# EAGLE design Pico Audio v0.10 (EAGLE 9.4.2)
COMPANY: AKSevenFour; CREVISION: v0.10; DATE: 30-10-2018; DRAWN: Adam Keher; TITLE: TinyPICO Audio Board
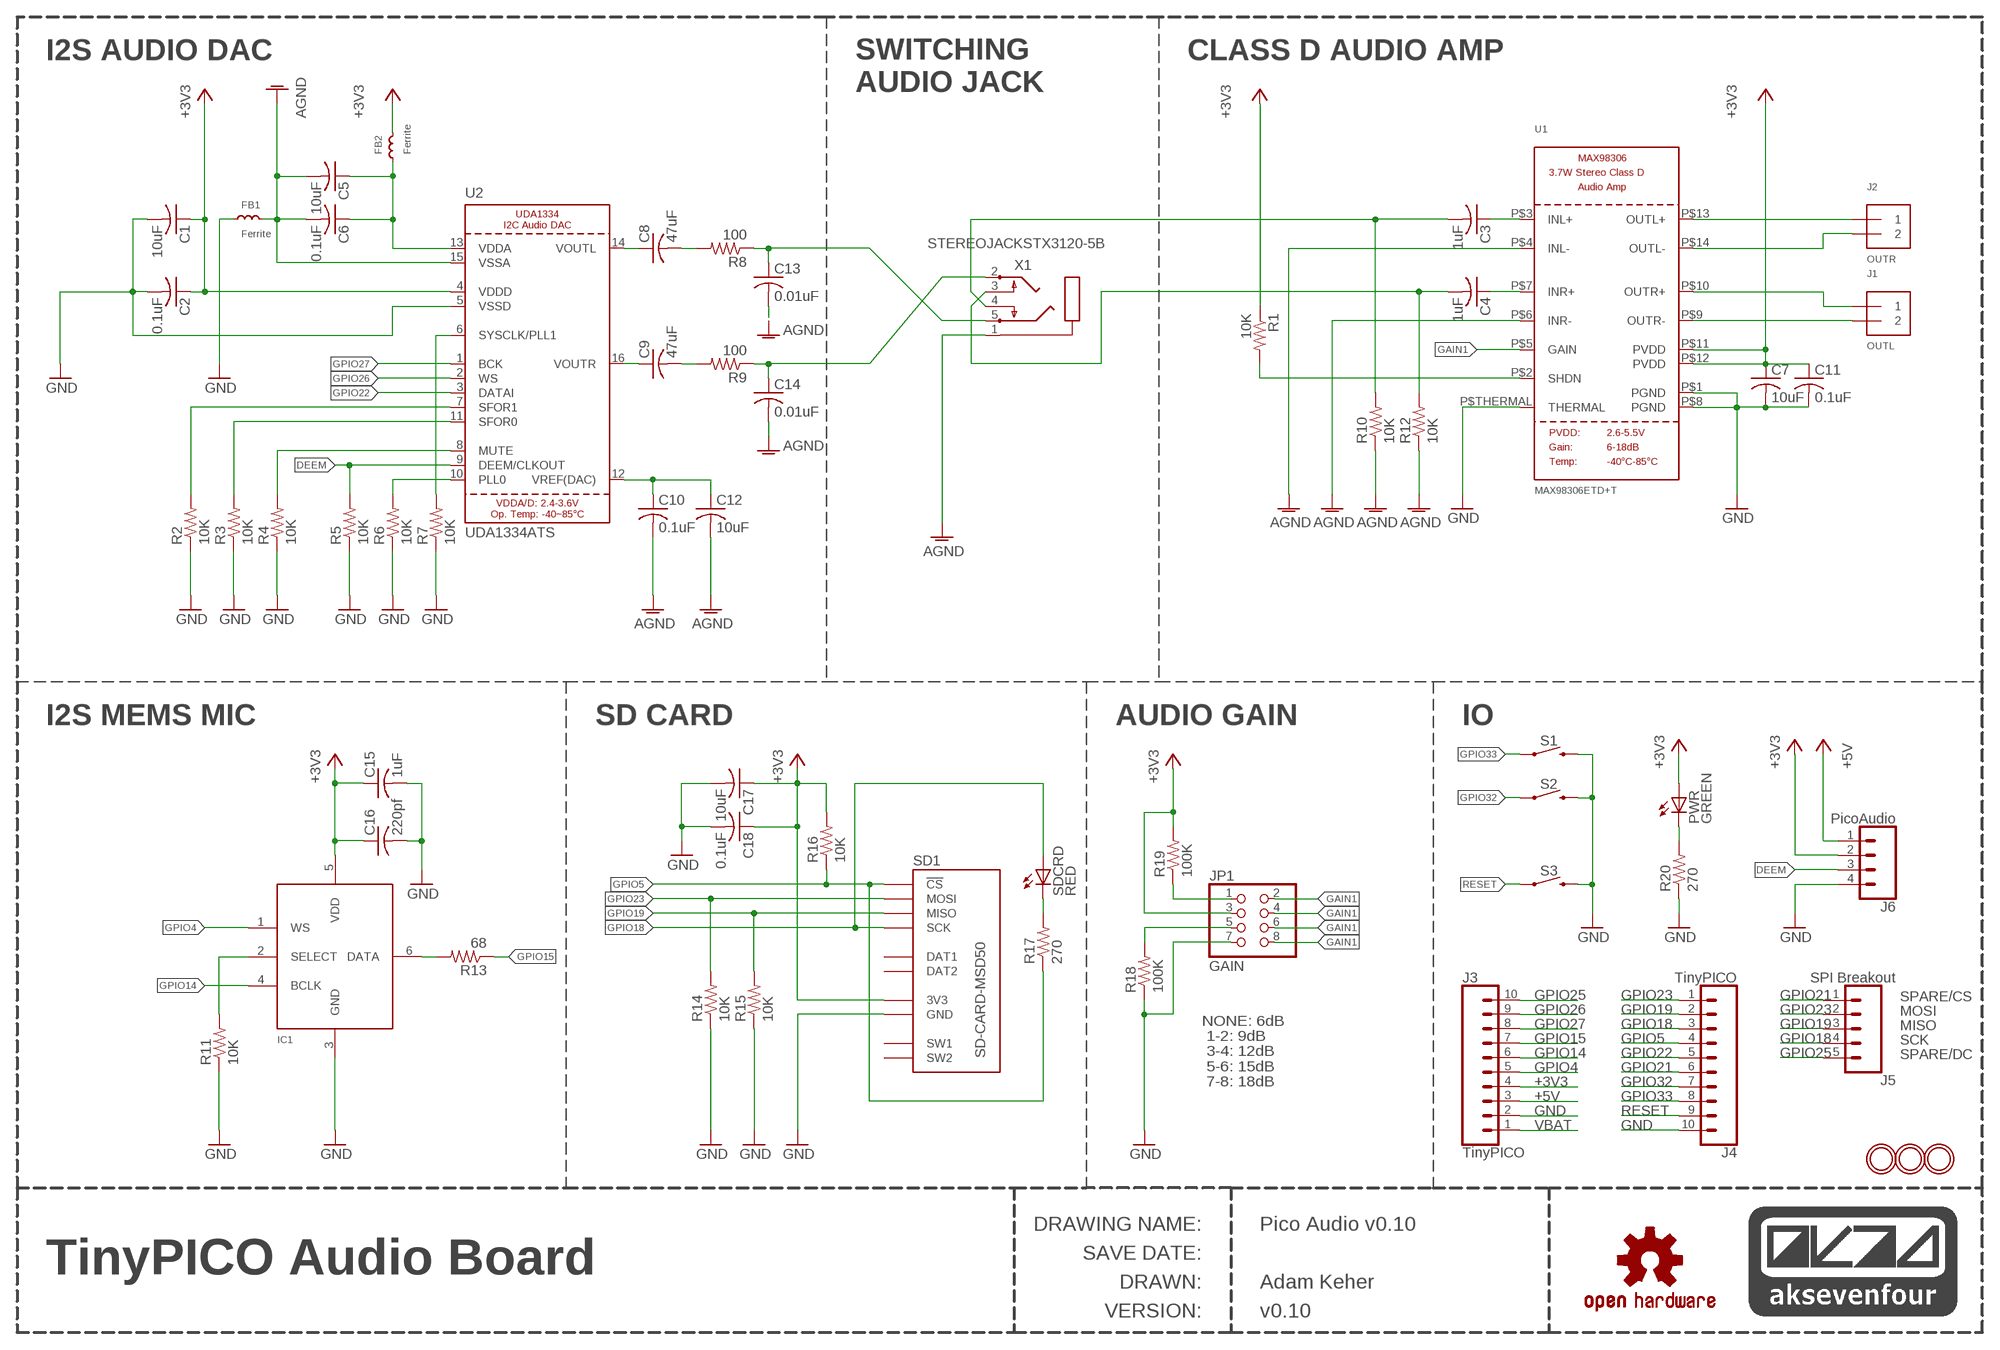
[diagram p0: schematic, sheet 1]

## Parts
AK74LOGO2  AK74_LOGO  [AK74_LOGO_MEDIUM_TEXTONLY]
C1  10uF  C-USC0603K  [C0603K]
C2  0.1uF  C-USC0402K  [C0402K]
C3  1uF  C-USC0402K  [C0402K]
C4  1uF  C-USC0402K  [C0402K]
C5  10uF  C-USC0603K  [C0603K]
C6  0.1uF  C-USC0402K  [C0402K]
C7  10uF  C-USC0603K  [C0603K]
C8  47uF  C-USC1210K  [C1210K]
C9  47uF  C-USC1210K  [C1210K]
C10  0.1uF  C-USC0402K  [C0402K]
C11  0.1uF  C-USC0402K  [C0402K]
C12  10uF  C-USC0603K  [C0603K]
C13  0.01uF  C-USC0402K  [C0402K]
C14  0.01uF  C-USC0402K  [C0402K]
C15  1uF  C-USC0402K  [C0402K]
C16  220pf  C-USC0402K  [C0402K]
C17  10uF  C-USC0603K  [C0603K]
C18  0.1uF  C-USC0402K  [C0402K]
FB1  Ferrite  FERRITEL0805  [R0805]
FB2  Ferrite  FERRITEL0805  [R0805]
IC1  MIC_I2S_SPH0645  [SPH0645LM4H]
J1  OUTL  TERMBLOCK_1X2  [TERMBLOCK_1X2-3.5MM]
J2  OUTR  TERMBLOCK_1X2  [TERMBLOCK_1X2-3.5MM]
J3  TinyPICO  TINYPICO_HEADER_10NO_SILK_PTH_FEMALE  [1X10_NO_SILK]
J4  TinyPICO  TINYPICO_HEADER_10NO_SILK_PTH_FEMALE  [1X10_NO_SILK]
J5  SPI Breakout  CONN_05NO_SILK  [1X05_NO_SILK]
J6  PicoAudio  CONN_041X04_NO_SILK  [1X04_NO_SILK]
JP1  GAIN  PINHD-2X4  [2X04]
LOGO2  OSHW-LOGOM  [OSHW-LOGO-M]
PWR  GREEN  LEDCHIP-LED0805  [CHIP-LED0805]
R1  10K  R-US_R0402  [R0402]
R2  10K  R-US_R0402  [R0402]
R3  10K  R-US_R0402  [R0402]
R4  10K  R-US_R0402  [R0402]
R5  10K  R-US_R0402  [R0402]
R6  10K  R-US_R0402  [R0402]
R7  10K  R-US_R0402  [R0402]
R8  100  R-US_R0402  [R0402]
R9  100  R-US_R0402  [R0402]
R10  10K  R-US_R0402  [R0402]
R11  10K  R-US_R0402  [R0402]
R12  10K  R-US_R0402  [R0402]
R13  68  R-US_R0402  [R0402]
R14  10K  R-US_R0402  [R0402]
R15  10K  R-US_R0402  [R0402]
R16  10K  R-US_R0402  [R0402]
R17  270  R-US_R0402  [R0402]
R18  100K  R-US_R0402  [R0402]
R19  100K  R-US_R0402  [R0402]
R20  270  R-US_R0402  [R0402]
S1  MOMENTARY-SWITCH-SPST-SMD-4.6X2.8MM  [TACTILE_SWITCH_SMD_4.6X2.8MM]
S2  MOMENTARY-SWITCH-SPST-SMD-4.6X2.8MM  [TACTILE_SWITCH_SMD_4.6X2.8MM]
S3  MOMENTARY-SWITCH-SPST-SMD-4.6X2.8MM  [TACTILE_SWITCH_SMD_4.6X2.8MM]
SD1  SD-CARD-MSD50  [SD_5031821853]
SDCRD  RED  LEDCHIP-LED0805  [CHIP-LED0805]
U1  MAX98306ETD+T  AUDIOAMP_MAX98306  [TDFN14_3X3MM]
U2  UDA1334ATS  AUDIO_I2S_UDA1334""  [SSOP16_4.4MM]
U$12  MOUNTINGHOLE2.5  [MOUNTINGHOLE_2.5_PLATED]
U$13  MOUNTINGHOLE2.5  [MOUNTINGHOLE_2.5_PLATED]
U$14  MOUNTINGHOLE2.5  [MOUNTINGHOLE_2.5_PLATED]
X1  STEREOJACKSTX3120-5B  [STX3100]

## Nets
+3V3 [power1]: C1.1 C2.1 C7.1 C11.1 C15.1 C16.1 C17.1 C18.1 FB2.2 IC1.5(VDD) J3.4 J6.2 JP1.3 PWR.A R1.1 R16.2 R19.2 SD1.VCC(3V3) U1.P$11(PVDD) U1.P$12(PVDD) U2.4(VDDD)
+5V [power1]: J3.3 J6.1
AGND [power1]: C5.2 C6.2 C10.2 C12.2 C13.2 C14.2 FB1.2 R10.1 R12.1 U1.P$4(INL-) U1.P$6(INR-) U2.15(VSSA) X1.1
DEEM: J6.3 R5.2 U2.9(DEEM/CLKOUT)
GAIN1: JP1.2 JP1.4 JP1.6 JP1.8 U1.P$5(GAIN)
GND [power1]: C1.2 C2.2 C7.2 C11.2 C15.2 C16.2 C17.2 C18.2 FB1.1 IC1.3(GND) J3.2 J4.10 J6.4 JP1.7 R2.1 R3.1 R4.1 R5.1 R6.1 R7.1 R11.1 R14.1 R15.1 R18.1 R20.1 S1.3 S1.4 S2.3 S2.4 S3.3 S3.4 SD1.GND U1.P$1(PGND) U1.P$8(PGND) U1.P$THERMAL(THERMAL) U2.5(VSSD)
GPIO4: IC1.1(WS) J3.5
GPIO5: J4.4 R16.1 R17.1 SD1.CS(!CS)
GPIO14: IC1.4(BCLK) J3.6
GPIO15: J3.7 R13.1
GPIO18: J4.3 J5.4 SD1.SCK SDCRD.A
GPIO19: J4.2 J5.3 R15.2 SD1.MISO
GPIO21: J4.6 J5.1
GPIO22: J4.5 U2.3(DATAI)
GPIO23: J4.1 J5.2 R14.2 SD1.MOSI
GPIO25: J3.10 J5.5
GPIO26: J3.9 U2.2(WS)
GPIO27: J3.8 U2.1(BCK)
GPIO32: J4.7 S2.1 S2.2
GPIO33: J4.8 S1.1 S1.2
N$1: C5.1 C6.1 FB2.1 U2.13(VDDA)
N$2: C3.1 U1.P$3(INL+)
N$3: R2.2 U2.7(SFOR1)
N$4: C4.1 U1.P$7(INR+)
N$5: R3.2 U2.11(SFOR0)
N$6: R4.2 U2.8(MUTE)
N$8: PWR.C R20.2
N$10: R6.2 U2.10(PLL0)
N$11: R7.2 U2.6(SYSCLK/PLL1)
N$14: C10.1 C12.1 U2.12(VREF(DAC))
N$15: C8.1 U2.14(VOUTL)
N$16: C9.2 R9.2
N$17 [power1]: J1.2 U1.P$9(OUTR-)
N$18 [power1]: J2.2 U1.P$14(OUTL-)
N$19: C8.2 R8.2
N$20: IC1.2(SELECT) R11.2
N$21: C9.1 U2.16(VOUTR)
N$22: IC1.6(DATA) R13.2
N$24: JP1.1 R19.1
N$25: JP1.5 R18.2
N$26 [power1]: J2.1 U1.P$13(OUTL+)
N$27: R17.2 SDCRD.C
N$28 [power1]: J1.1 U1.P$10(OUTR+)
RESET: J4.9 S3.1 S3.2
SHUTDOWN: R1.2 U1.P$2(SHDN)
VBAT [power1]: J3.1
VINL [power1]: C3.2 R10.2 X1.4
VINR [power1]: C4.2 R12.2 X1.3
VOUTL [power1]: C13.1 R8.1 X1.5
VOUTR [power1]: C14.1 R9.1 X1.2
Unconnected: SD1.DAT1 SD1.DAT2 SD1.SW1 SD1.SW2

## Notes on the sheet
- I2S AUDIO DAC | CLASS D AUDIO AMP
- SWITCHING
  AUDIO JACK
- I2S MEMS MIC | SD CARD | AUDIO GAIN | IO
- SPARE/CS
- MOSI
- MISO
- SCK
- SPARE/DC
- NONE: 6dB
   1-2: 9dB
   3-4: 12dB
   5-6: 15dB
   7-8: 18dB
- DRAWING NAME:
- SAVE DATE:
- DRAWN:
- VERSION:

## Library data of the parts
AK74LOGO2 = AK74:AK74_LOGO
C1-C18 = rcl:C-US: CAPACITOR, American symbol; SPICEPREFIX: C
FB1 FB2 = AK74:FERRITE
IC1 = microbuilder:MIC_I2S
J1 J2 = microbuilder:TERMBLOCK_1X2: 3.5mm Terminal block http://www.ladyada.net/library/pcb/eaglelibrary.html
J3 J4 = UnexpectedMaker:TINYPICO_HEADER_10: Multi connection point. Often used as Generic Header-pin footprint for 0.1 inch spaced/style header connections On any of the 0.1 inch spaced packages, you can populate with these: Break Away Headers - Straight <https://www.sparkfun.com/products/116> (PRT-00116) Break Away Male Headers - Right Angle <https://www.sparkfun.com/products/553> (PRT-00553) Female Headers <https://www.sparkfun.com/products/115> (PRT-00115) Break Away Headers - Machine Pin <https://www.sparkfun.com/products/117> (PRT-00117) Break Away Female Headers - Swiss Machine Pin <https://www.sparkfun.com/products/743> (PRT-00743) Arduino Stackable Header - 10 Pin <https://www.sparkfun.com/products/11376> (PRT-11376) For SCREWTERMINALS and SPRING TERMINALS visit here: Screw Terimnals on SparkFun.com <https://www.sparkfun.com/search/results?term=Screw+Terminals> (5mm/3.5mm/2.54mm spacing) This device is also useful as a general connection point to wire up your design to another part of your project. Our various solder wires solder well into these plated through hole pads. Hook-Up Wire - Assortment (Stranded, 22 AWG) <https://www.sparkfun.com/products/11375> (PRT-11375) Hook-Up Wire - Assortment (Solid Core, 22 AWG) <https://www.sparkfun.com/products/11367> (PRT-11367) View the entire wire category on our website here <https://www.sparkfun.com/categories/141> Special notes: Molex polarized connector foot print use with SKU : PRT-08231 with associated crimp pins and housings. 1MM SMD Version SKU: PRT-10208 NOTES ON THE VARIANTS LOCK and LOCK_LONGPADS... This footprint was designed to help hold the alignment of a through-hole component (i.e. 6-pin header) while soldering it into place. You may notice that each hole has been shifted either up or down by 0.005 of an inch from it's more standard position (which is a perfectly straight line). This slight alteration caused the pins (the squares in the middle) to touch the edges of the holes. Because they are alternating, it causes a "brace" to hold the component in place. 0.005 has proven to be the perfect amount of "off-center" position when using our standard breakaway headers. Although looks a little odd when you look at the bare footprint, once you have a header in there, the alteration is very hard to notice. Also,if you push a header all the way into place, it is covered up entirely on the bottom side.; PROD_ID: CONN-11563
J5 = SparkFun-Connectors:CONN_05: Multi connection point. Often used as Generic Header-pin footprint for 0.1 inch spaced/style header connections On any of the 0.1 inch spaced packages, you can populate with these: Break Away Headers - Straight <https://www.sparkfun.com/products/116> (PRT-00116) Break Away Male Headers - Right Angle <https://www.sparkfun.com/products/553> (PRT-00553) Female Headers <https://www.sparkfun.com/products/115> (PRT-00115) Break Away Headers - Machine Pin <https://www.sparkfun.com/products/117> (PRT-00117) Break Away Female Headers - Swiss Machine Pin <https://www.sparkfun.com/products/743> (PRT-00743) For SCREWTERMINALS and SPRING TERMINALS visit here: Screw Terimnals on SparkFun.com <https://www.sparkfun.com/search/results?term=Screw+Terminals> (5mm/3.5mm/2.54mm spacing) This device is also useful as a general connection point to wire up your design to another part of your project. Our various solder wires solder well into these plated through hole pads. Hook-Up Wire - Assortment (Stranded, 22 AWG) <https://www.sparkfun.com/products/11375> (PRT-11375) Hook-Up Wire - Assortment (Solid Core, 22 AWG) <https://www.sparkfun.com/products/11367> (PRT-11367) View the entire wire category on our website here <https://www.sparkfun.com/categories/141> Special notes: Molex polarized connector foot print use with SKU : PRT-08231 with associated crimp pins and housings. 1MM SMD Version SKU: PRT-10208
J6 = SparkFun-Connectors:CONN_04: Multi connection point. Often used as Generic Header-pin footprint for 0.1 inch spaced/style header connections On any of the 0.1 inch spaced packages, you can populate with these: Break Away Headers - Straight <https://www.sparkfun.com/products/116> (PRT-00116) Break Away Male Headers - Right Angle <https://www.sparkfun.com/products/553> (PRT-00553) Female Headers <https://www.sparkfun.com/products/115> (PRT-00115) Break Away Headers - Machine Pin <https://www.sparkfun.com/products/117> (PRT-00117) Break Away Female Headers - Swiss Machine Pin <https://www.sparkfun.com/products/743> (PRT-00743) For SCREWTERMINALS and SPRING TERMINALS visit here: Screw Terimnals on SparkFun.com <https://www.sparkfun.com/search/results?term=Screw+Terminals> (5mm/3.5mm/2.54mm spacing) This device is also useful as a general connection point to wire up your design to another part of your project. Our various solder wires solder well into these plated through hole pads. Hook-Up Wire - Assortment (Stranded, 22 AWG) <https://www.sparkfun.com/products/11375> (PRT-11375) Hook-Up Wire - Assortment (Solid Core, 22 AWG) <https://www.sparkfun.com/products/11367> (PRT-11367) View the entire wire category on our website here <https://www.sparkfun.com/categories/141> Special notes: Molex polarized connector foot print use with SKU : PRT-08231 with associated crimp pins and housings. 1MM SMD Version SKU: PRT-10208; PROD_ID: CONN-09696
JP1 = pinhead:PINHD-2X4: PIN HEADER
LOGO2 = SparkFun-Aesthetics:OSHW-LOGO: Open Source Hardware Logo This logo indicates the piece of hardware it is found on incorporates a OSHW license and/or adheres to the definition of open source hardware found here: http://freedomdefined.org/OSHW
PWR SDCRD = led:LED: LED OSRAM: - CHIPLED LG R971, LG N971, LY N971, LG Q971, LY Q971, LO R971, LY R971 LH N974, LH R974 LS Q976, LO Q976, LY Q976 LO Q996 - Hyper CHIPLED LW Q18S LB Q993, LB Q99A, LB R99A - SideLED LS A670, LO A670, LY A670, LG A670, LP A670 LB A673, LV A673, LT A673, LW A673 LH A674 LY A675 LS A676, LA A676, LO A676, LY A676, LW A676 LS A679, LY A679, LG A679 - Hyper Micro SIDELED® LS Y876, LA Y876, LO Y876, LY Y876 LT Y87S - SmartLED LW L88C, LW L88S LB L89C, LB L89S, LG L890 LS L89K, LO L89K, LY L89K LS L896, LA L896, LO L896, LY L896 - TOPLED LS T670, LO T670, LY T670, LG T670, LP T670 LSG T670, LSP T670, LSY T670, LOP T670, LYG T670 LG T671, LOG T671, LSG T671 LB T673, LV T673, LT T673, LW T673 LH T674 LS T676, LA T676, LO T676, LY T676, LB T676, LH T676, LSB T676, LW T676 LB T67C, LV T67C, LT T67C, LS T67K, LO T67K, LY T67K, LW E67C LS E67B, LA E67B, LO E67B, LY E67B, LB E67C, LV E67C, LT E67C LW T67C LS T679, LY T679, LG T679 LS T770, LO T770, LY T770, LG T770, LP T770 LB T773, LV T773, LT T773, LW T773 LH T774 LS E675, LA E675, LY E675, LS T675 LS T776, LA T776, LO T776, LY T776, LB T776 LHGB T686 LT T68C, LB T68C - Hyper Mini TOPLED® LB M676 - Mini TOPLED Santana® LG M470 LS M47K, LO M47K, LY M47K Source: http://www.osram.convergy.de LUXEON: - LUMILED® LXK2-PW12-R00, LXK2-PW12-S00, LXK2-PW14-U00, LXK2-PW14-V00 LXK2-PM12-R00, LXK2-PM12-S00, LXK2-PM14-U00 LXK2-PE12-Q00, LXK2-PE12-R00, LXK2-PE12-S00, LXK2-PE14-T00, LXK2-PE14-U00 LXK2-PB12-K00, LXK2-PB12-L00, LXK2-PB12-M00, LXK2-PB14-N00, LXK2-PB14-P00, LXK2-PB14-Q00 LXK2-PR12-L00, LXK2-PR12-M00, LXK2-PR14-Q00, LXK2-PR14-R00 LXK2-PD12-Q00, LXK2-PD12-R00, LXK2-PD12-S00 LXK2-PH12-R00, LXK2-PH12-S00 LXK2-PL12-P00, LXK2-PL12-Q00, LXK2-PL12-R00 Source: www.luxeon.com KINGBRIGHT: KA-3528ASYC Source: www.kingbright.com
R1-R20 = rcl:R-US_: RESISTOR, American symbol; SPICEPREFIX: R
S1-S3 = SparkFun-Switches:MOMENTARY-SWITCH-SPST: Momentary Switch (Pushbutton) - SPST Normally-open (NO) SPST momentary switches (buttons, pushbuttons). Variants PTH-12MM - 12mm square, through-hole Momentary Pushbutton Switch - 12mm Square <https://www.sparkfun.com/products/9190> (COM-09190) PTH-6.0MM, PTH-6.0MM-KIT - 6.0mm square, through-hole Mini Pushbutton Switch <https://www.sparkfun.com/products/97> (COM-00097) KIT package intended for soldering kit's - only one side of pads' copper is exposed. PTH-RIGHT-ANGLE-KIT - Right-angle, through-hole Right Angle Tactile Button <https://www.sparkfun.com/products/10791> - Used on SparkFun BigTime Watch Kit <https://www.sparkfun.com/products/11734> SMD-12MM - 12mm square, surface-mount Tactile Button - SMD (12mm) <https://www.sparkfun.com/products/12993> (COM-12993) Used on SparkFun PicoBoard <https://www.sparkfun.com/products/11888> SMD-4.5MM - 4.5mm Square Trackball Switch Used on SparkFun Blackberry Trackballer Breakout <https://www.sparkfun.com/products/13169> SMD-4.6MMX2.8MM - 4.60mm x 2.80mm, surface mount Used on SparkFun SAMD21 Mini Breakout <https://www.sparkfun.com/products/13664> SMD-5.2MM, SMD-5.2-REDUNDANT - 5.2mm square, surface-mount Mini Pushbutton Switch - SMD <https://www.sparkfun.com/products/8720> (COM-08720) Used on Arduino Pro Mini <https://www.sparkfun.com/products/11114> REDUNDANT package connects both switch circuits together SMD-6.0X3.5MM - 6.0 x 3.5mm, surface mount Momentary Reset Switch SMD <https://www.sparkfun.com/products/8229> (COM-08229) SMD-6.2MM-TALL - 6.2mm square, surface mount Tactile Button - SMD (6mm) <https://www.sparkfun.com/products/12992> Used on SparkFun Digital Sandbox <https://www.sparkfun.com/products/12651> SMD-RIGHT-ANGLE - Right-angle, surface mount Used on SparkFun Block for Intel® Edison - Arduino <https://www.sparkfun.com/products/13036>; PROD_ID: SWCH-13065
SD1 = we-con:SD-CARD: SD-Card Sockets; DIGIKEY: WM9750TR-ND
U1 = microbuilder:AUDIOAMP_MAX98306: MAX98306 3.7W Stereo Audio Amp - TDFN14 3.7W @ 3 ohm, 2.6-5.5V supply, 6-18dB selectable gain
U2 = microbuilder:AUDIO_I2S_UDA1334: UDA1334 I2C Audio DAC Power Supply: 2.4-3.6V Sample frequencies from 16-100kHz
U$12-U$14 = microbuilder:MOUNTINGHOLE: Mounting Hole For #2 screws (0.086"/2.18mm width, 0.094"/2.4mm hole) use 2.5mm; BOM: EXCLUDE
X1 = AK74:STEREOJACK: MIC/HEADPHONE JACK Stereo jack with two switches. Kycon STX3100, CUI SJ1-3555NG and/or 4UCon 05544

## Net classes
0 default: width 0.152 mm
1 power1: width 0.254 mm

## Board
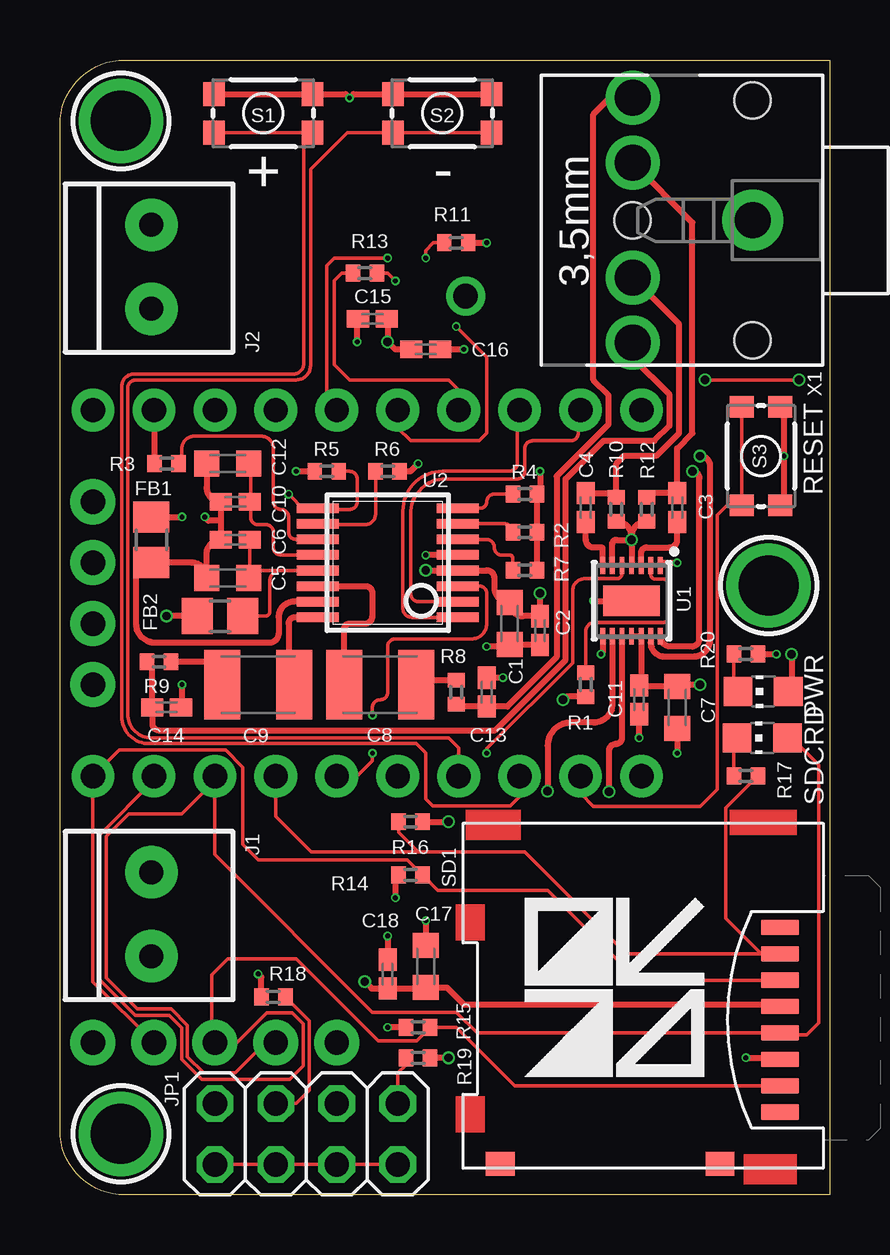
[diagram p1: board, top side]
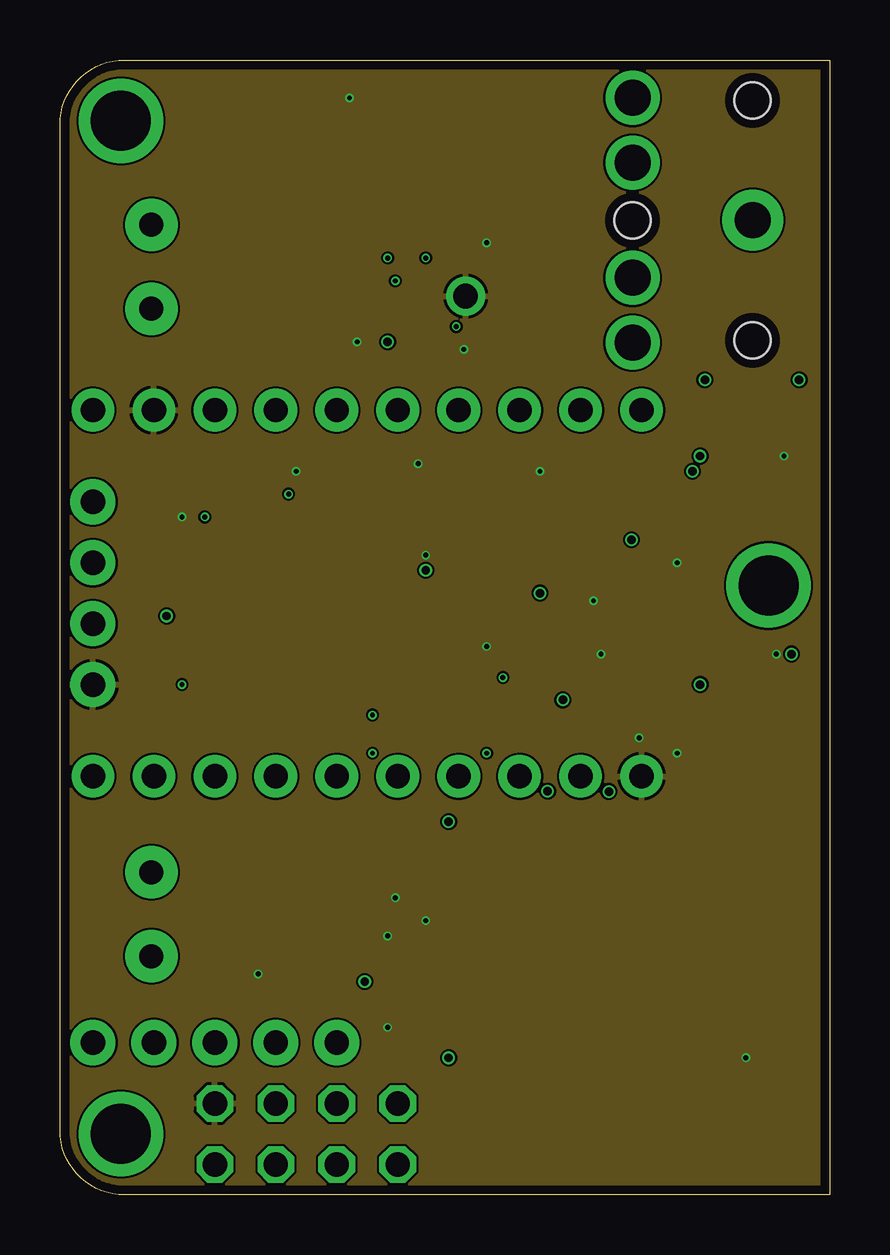
[diagram p2: board, inner layer GND]
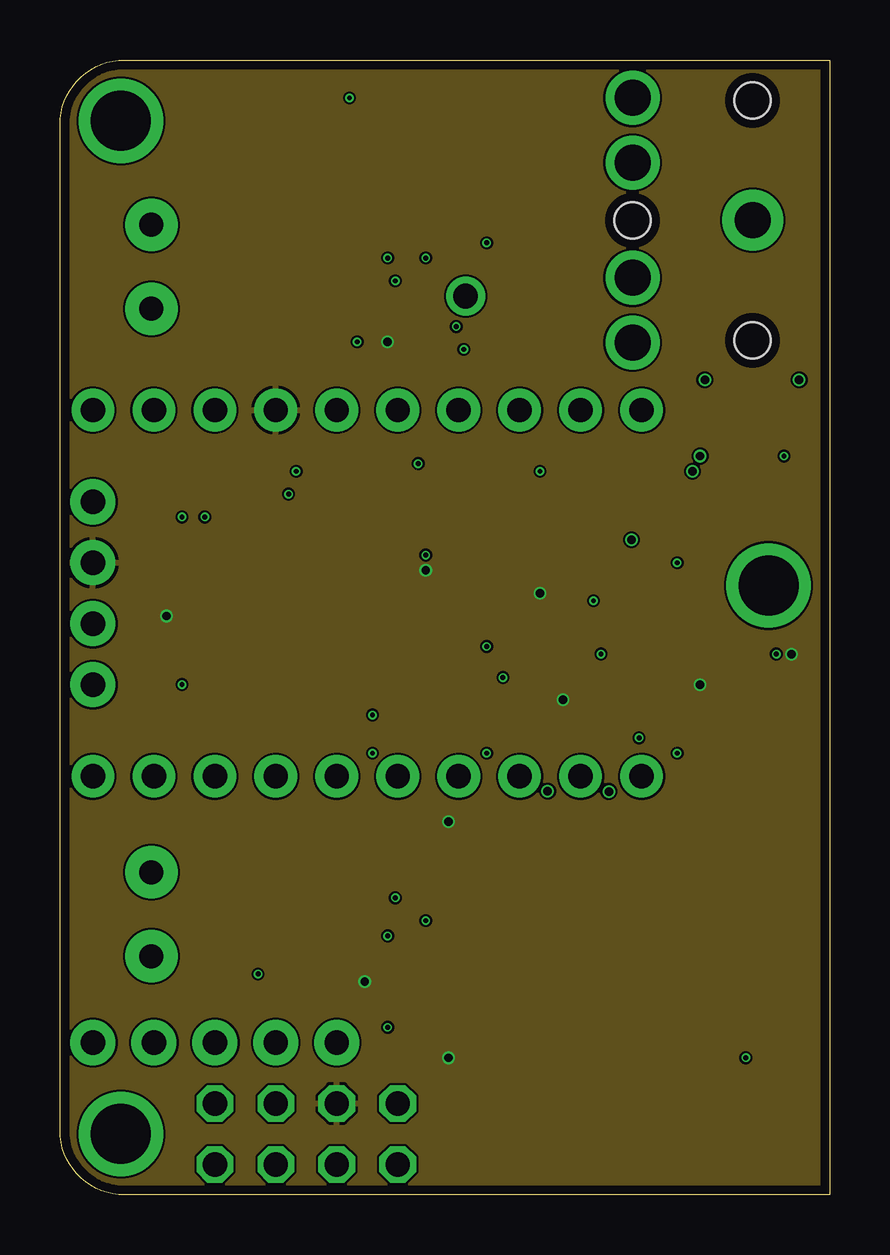
[diagram p3: board, inner layer PWR]
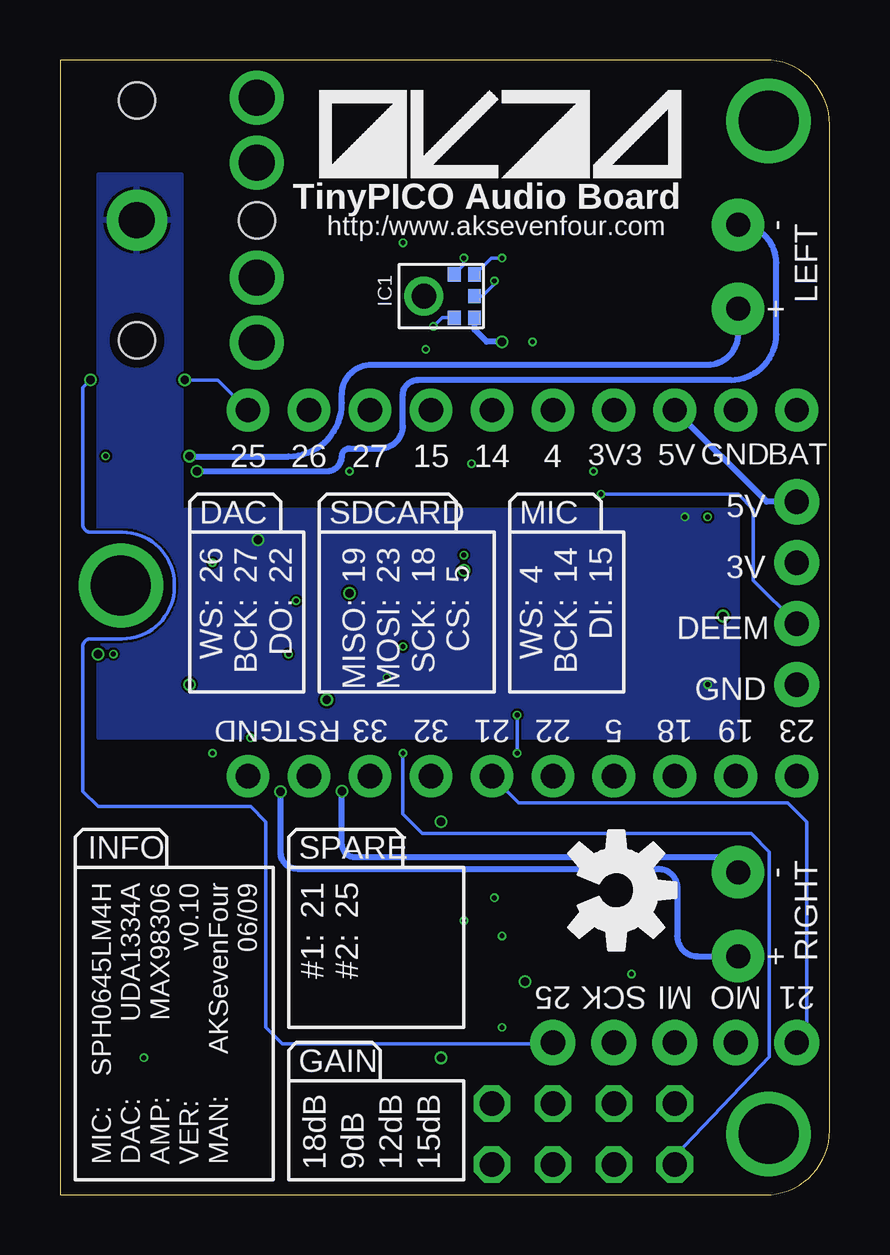
[diagram p4: board, bottom side, seen from below]

Size 32.07 x 47.31 mm. Coordinates in mm from the lower left corner, seen from the top.
Outline: 32.07,0 2.69,0 arc-90 0,2.69 0,44.62 arc-90 2.69,47.31 32.07,47.31 32.07,0
Copper layers (1+2*15+16): Top 0.07mm / dielectric 1.5mm / GND 0.035mm / dielectric 0.15mm / PWR 0.035mm / dielectric 0.2mm / Bottom 0.07mm
Design rules "jlcpcb-4layer-updated": minimum track width 3.5mil, minimum drill 0.2mm, track to track 3.5mil, track to pad 5mil, pad to pad 5mil, via to via 5mil, smd to smd 5mil, copper to edge 15mil, drill to drill 5mil, minimum pad ring 7mil, minimum via ring 3mil, stop-mask expansion 3mil, vias tented up to drill 20mil, thermal gap 5mil

### Footprints (pad centres in the part's own frame; a part is rotated, then mirrored left to right if it is on the bottom)
C0603K = smd 1.05 x 1.08: 1 -0.875,0; 2 0.875,0
C0402K = smd 0.925 x 0.74: 1 -0.6,0; 2 0.6,0
C1210K = smd 1.5 x 2.9: 1 -1.5,0; 2 1.5,0
R0805 = smd 1.3 x 1.5: 1 -0.95,0; 2 0.95,0
SPH0645LM4H = smd 0.6 x 0.525: 1 -0.9,1.4; 2 -0.9,0.55; 4 0.9,0.55; 5 0.9,1.4; 6 0,1.4 | drill 1.025 pad 1.625: 3 0,-0.71
TERMBLOCK_1X2-3.5MM = drill 1 pad 2.184: 1 1.8,0; 2 -1.7,0
1X10_NO_SILK = drill 1.016 pad 1.778: 1 0,0; 2 2.54,0; 3 5.08,0; 4 7.62,0; 5 10.16,0; 6 12.7,0; 7 15.24,0; 8 17.78,0; 9 20.32,0; 10 22.86,0
1X05_NO_SILK = drill 1.016 pad 1.88: 1 0,0; 2 2.54,0; 3 5.08,0; 4 7.62,0; 5 10.16,0
1X04_NO_SILK = drill 1.016 pad 1.88: 1 0,0; 2 2.54,0; 3 5.08,0; 4 7.62,0
2X04 = drill 1.016 octagon: 1 -3.81,-1.27; 2 -3.81,1.27; 3 -1.27,-1.27; 4 -1.27,1.27; 5 1.27,-1.27; 6 1.27,1.27; 7 3.81,-1.27; 8 3.81,1.27
CHIP-LED0805 = smd 1.2 x 1.2: A 0,-1.05; C 0,1.05
R0402 = smd 0.6 x 0.7: 1 -0.5,0; 2 0.5,0
TACTILE_SWITCH_SMD_4.6X2.8MM = smd 0.9 x 1: 1 -2.05,-0.8; 2 2.05,-0.8; 3 2.05,0.8; 4 -2.05,0.8
SD_5031821853 = smd 0.65 x 1.6: CS 2.75,0.8; DAT1 -3.85,0.8; DAT2 3.85,0.8; GND -1.65,0.8; MISO -2.75,0.8; MOSI 1.65,0.8; SCK -0.55,0.8; VCC 0.55,0.8 | smd 1 x 1.2: SW1 -6,12.45; SW2 -6,3.3
TDFN14_3X3MM = smd 0.7 x 0.2: P$1 -1.475,1.2; P$2 -1.475,0.8; P$3 -1.475,0.4; P$4 -1.475,0; P$5 -1.475,-0.4; P$6 -1.475,-0.8; P$7 -1.475,-1.2; P$8 1.475,-1.2; P$9 1.475,-0.8; P$10 1.475,-0.4; P$11 1.475,0; P$12 1.475,0.4; P$13 1.475,0.8; P$14 1.475,1.2 | smd 1.27 x 2.35: P$THERMAL 0,0
SSOP16_4.4MM = smd 0.4 x 1.75: 1 -2.275,-2.92; 2 -1.625,-2.92; 3 -0.975,-2.92; 4 -0.325,-2.92; 5 0.325,-2.92; 6 0.975,-2.92; 7 1.625,-2.92; 8 2.275,-2.92; 9 2.275,2.92; 10 1.625,2.92; 11 0.975,2.92; 12 0.325,2.92; 13 -0.325,2.92; 14 -0.975,2.92; 15 -1.625,2.92; 16 -2.275,2.92
MOUNTINGHOLE_2.5_PLATED = drill 2.5 pad 3.2: P$1 0,0
STX3100 = drill 1.5 pad 2.54: 1 2.7,-0.1 | drill 1.5: 2 7.7,5; 3 7.7,2.3; 4 7.7,-2.5; 5 7.7,-5.2 | hole 1.5: 2.7,4.9; 2.7,-5.1; 7.7,-0.1

### Placement (x,y rotation side)
AK74LOGO2  13.97,44.45 0 bottom
C1  18.73,23.81 270 top
C2  20,23.52 270 top
C3  25.72,28.65 90 top
C4  21.91,28.65 90 top
C5  6.99,25.72 180 top
C6  7.3,27.3 180 top
C7  25.72,20.32 270 top
C8  13.34,21.27 0 top
C9  8.26,21.27 180 top
C10  7.3,28.89 180 top
C11  24.13,20.64 270 top
C12  6.99,30.48 180 top
C13  17.78,20.95 90 top
C14  4.45,20.32 0 top
C15  13.02,36.51 180 top
C16  15.24,35.24 0 top
C17  15.24,9.53 90 top
C18  13.65,9.21 90 top
FB1  3.81,27.3 270 top
FB2  6.67,24.13 180 top
IC1  16.19,37.47 270 bottom
J1  3.81,11.75 270 top
J2  3.81,38.73 270 top
J3  1.37,32.72 0 top
J4  1.37,17.45 0 top
J5  1.37,6.35 0 top
J6  1.37,28.89 270 top
JP1  10.26,2.54 180 top
LOGO2  8.89,12.7 270 bottom
PWR  29.3,20.98 90 top
R1  21.91,21.27 90 top
R2  19.37,27.62 180 top
R3  4.45,30.48 0 top
R4  19.37,29.21 180 top
R5  11.11,30.16 0 top
R6  13.65,30.16 180 top
R7  19.37,26.04 180 top
R8  16.51,20.95 90 top
R9  4.13,22.23 0 top
R10  24.45,28.57 90 top
R11  16.51,39.69 180 top
R12  23.18,28.57 90 top
R13  12.7,38.42 0 top
R14  14.61,13.34 0 top
R15  14.92,6.99 0 top
R16  14.61,15.56 0 top
R17  28.57,17.46 180 top
R18  8.89,8.26 0 top
R19  14.92,5.71 0 top
R20  28.57,22.54 180 top
S1  8.47,45.09 0 top
S2  15.93,45.09 0 top
S3  29.21,30.8 270 top
SD1  30.8,7.3 90 top
SDCRD  29.26,19.05 90 top
U1  23.81,24.77 270 top
U2  13.65,26.35 90 top
U$1  [AK74_LOGO_MEDIUM_TEXTONLY_SQUARE]  26.67,10.79 0 top
U$12  2.54,2.54 0 top
U$13  2.54,44.77 0 top
U$14  29.53,25.4 0 top
X1  31.56,40.53 180 top

### Tracks (layer width: path | path; a pad name or v marks a point on that pad's centre or on a via)
+3V3  (via drill 0.35)
  Top 0.254: v15.24,26.04 U2.4 | U2.4 | SD1.VCC 29.91,7.94 16.83,7.94 16.11,8.65 C17.1 15.2,8.61 C18.1 12.98,8.61 v12.7,8.89 | v16.19,5.71 R19.2 | R16.2 v16.19,15.56 | 24.21,21.32 U1.P$12 U1.P$11 | 24.21,21.32 C11.1 | R1.1 21.09,20.77 v20.95,20.64 | U2.4 arc-90 U2.4 | U2.4 17.78,26.04 arc-90 18.1,25.72 18.1,25.32 arc90 C1.1 arc90 19.3,24.12 C2.1 v20,25.08 | v26.67,21.27 25.8,21.27 C7.1 24.34,21.2 24.21,21.32 | FB2.2 v4.45,24.13 | PWR.A 30.48,21.11 v30.48,22.54 | C15.1 13.65,36.48 v13.65,35.56 13.97,35.24 C16.1
  Bottom 0.254: v13.65,35.56 14.29,35.56 14.79,36.06 IC1.5
  pour PWR: -1.27,48.58 -1.27,-1.27 33.34,-1.27 33.34,48.58
+5V
  Bottom 0.254: J3.3 2.63,28.89 J6.1
AGND  (via drill 0.2, 0.35)
  Top 0.254: v23.81,27.3 U1.P$4 | U1.P$6 23.01,27.14 arc-90 23.18,27.3 v23.81,27.3 | R12.1 arc-90 23.81,27.44 | v23.81,27.3 23.81,27.44 | 23.81,27.44 arc-90 R10.1 | C13.2 17.79,21.57 v18.45,21.57 | v5.08,21.27 5.08,20.36 C14.2 | U2.15 9.75,24.73 arc90 9.11,24.08 9.11,23.39 arc-90 8.72,23.01 3.98,23.01 arc-90 3.17,23.81 3.17,25.72 arc-90 FB1.2 5.47,26.36 arc-90 C5.2 6.11,26.71 arc-90 C6.2 6.7,28.11 | C12.2 6.11,29.48 arc90 C10.2 6.7,28.11 | 6.7,28.11 6.18,28.11 v6.03,28.26
  pour Bottom: 3.81,28.57 3.81,19.05 30.48,19.05 30.48,42.55 26.99,42.55 26.99,28.57
DEEM  (via drill 0.2)
  Top 0.152: U2.9 10.82,28.54 10.85,28.57 | v9.53,29.21 10.16,28.57 10.85,28.57 | R5.2 12.06,30.16 arc-90 12.38,29.84 12.38,28.89 arc-90 12.06,28.57 10.85,28.57
  Bottom 0.152: J6.3 3.17,25.62 3.17,28.57 3.81,29.21 v9.53,29.21
GAIN1  (via drill 0.2)
  Top 0.152: JP1.2 JP1.4 JP1.6 JP1.8 | v17.78,18.41 17.78,18.6 21.36,22.18 21.36,25.17 arc-90 21.88,25.69 23.2,25.69 arc90 23.41,25.9 U1.P$5
  Bottom 0.152: JP1.8 6.45,1.6 2.52,5.76 2.52,14.3 3.27,15.06 16.96,15.06 17.78,15.88 v17.78,18.41
GND  (via drill 0.2)
  Top 0.254: S3.3 30.16,28.9 v30.16,30.8 30.16,32.7 S3.4 | v20,30.16 20,29.34 R4.1 R2.1 R7.1 | U2.5 v15.24,26.67 | v14.92,30.48 14.61,30.16 R6.1 | v9.84,30.16 R5.1 | R15.1 v13.65,6.99 | R14.1 13.97,13.2 v13.97,12.38 | S2.3 S2.4 12.23,45.88 v12.06,45.72 11.9,45.88 S1.3 S1.4 | v28.57,5.71 29.93,5.71 SD1.GND | v15.24,11.43 C17.2 | v13.65,10.79 C18.2 | U1.P$1 25.12,26.35 v25.72,26.35 | v22.23,24.77 U1.P$THERMAL | U1.P$8 22.61,22.61 v22.54,22.54 | v24.13,19.05 C11.2 | C7.2 v25.72,18.41 | R18.1 8.39,9.07 v8.26,9.21 | C2.2 arc90 19.98,22.94 C1.2 arc-90 18.66,22.86 v17.78,22.86 | FB1.1 v5.08,28.25 arc-90 v5.08,28.26 | R20.1 v29.84,22.54 | R3.1 3.94,32.68 arc90 J3.2 | v12.38,35.56 12.38,36.48 C15.2 | v16.83,35.24 C16.2 | R11.1 v17.78,39.69
  pour GND (rank 2): -0.64,47.94 -0.64,-0.64 32.7,-0.64 32.7,47.94
GPIO4  (via drill 0.2)
  Top 0.152: J3.5 11.11,33.13 11.11,38.73 11.43,39.05 v13.65,39.05
  Bottom 0.152: IC1.1 14.11,39.05 v13.65,39.05
GPIO5
  Top 0.152: SD1.CS 29.21,10.05 | 29.21,10.05 23.6,10.05 19.37,14.29 14.92,14.29 | J4.4 8.99,15.77 10.48,14.29 14.92,14.29 | R17.1 27.73,16.12 27.73,11.53 29.21,10.05 | R16.1 14.11,15.11 14.92,14.29
GPIO14  (via drill 0.2)
  Top 0.152: J3.6 14.07,31.97 14.61,31.43 17.46,31.43 17.78,31.75 17.78,34.92 v16.51,36.2
  Bottom 0.152: IC1.4 16.14,36.56 v16.51,36.2
GPIO15
  Top 0.152: J3.7 16.61,33.55 16.19,33.97 12.06,33.97 11.43,34.61 11.43,38.1 11.75,38.42 R13.1
GPIO18
  Top 0.152: SDCRD.A 30.48,19.05 31.61,17.92 31.61,7.16 31.11,6.67 30.08,6.67 SD1.SCK 17.38,6.75 16.51,7.62 13.02,7.62 6.45,14.19 J4.3 6.45,17.25 5.08,15.88 2.86,15.88 1.93,14.95 1.93,9.04 3.23,7.75 4.64,7.75 5.31,7.07 5.31,5.75 5.98,5.08 7.3,5.08 8.57,6.35 J5.4
GPIO19
  Top 0.152: SD1.MISO 18.94,4.55 16.51,6.99 R15.2 14.86,6.43 13.26,6.43 9.84,9.84 6.99,9.84 6.33,9.18 6.33,6.48 J5.3 7.38,6.35 8.62,7.59 9.67,7.59 10.13,7.13 10.13,5.37 9.58,4.81 5.91,4.81 5.07,5.65 5.07,6.97 4.55,7.49 3.13,7.49 1.63,8.99 1.63,14.98 3.91,17.27 J4.2
GPIO21
  Bottom 0.152: J5.1 0.95,6.77 0.95,15.56 1.74,16.34 12.96,16.34 J4.6
GPIO22  (via drill 0.2)
  Top 0.152: U2.3 17.48,25.38 arc-90 17.78,25.08 17.78,23.81 arc-90 17.14,23.18 13.97,23.18 arc90 13.65,22.86 13.65,20.95 arc-90 13.34,20.64 arc90 13.02,20.32 v13.02,20 | J4.5 11.54,17.46 12.38,17.46 13.02,18.1 v13.02,18.41
  Bottom 0.152: v13.02,20 v13.02,18.41
GPIO23
  Top 0.152: SD1.MOSI 24.07,8.95 20.32,12.7 15.74,12.7 R14.2 14.47,13.97 8.26,13.97 7.62,14.61 7.62,17.83 6.9,18.54 2.46,18.54 J4.1 1.37,8.89 J5.2
GPIO25  (via drill 0.35)
  Top 0.152: v26.87,33.97 v30.8,33.97
  Bottom 0.152: J3.10 25.49,33.97 v26.87,33.97 | v30.8,33.97 31.11,33.66 31.11,27.94 arc-90 30.8,27.62 29.47,27.62 arc45 27.94,26.99 arc45 27.3,25.45 27.3,25.35 arc45 27.94,23.81 arc45 29.47,23.18 30.8,23.18 arc-90 31.11,22.86 31.11,16.83 30.48,16.19 24.13,16.19 23.5,15.56 23.5,6.99 22.8,6.29 11.59,6.29 J5.5
GPIO26
  Top 0.152: U2.2 14.96,24.73 arc-90 14.61,25.08 14.61,28.38 arc-90 16.07,29.84 19.05,29.84 arc90 19.37,30.16 19.37,31.11 arc-90 19.68,31.43 21.27,31.43 arc90 21.59,31.75 21.59,32.61 arc-90 J3.9
GPIO27
  Top 0.152: J3.8 19.05,32.61 19.05,30.48 arc-90 18.73,30.16 15.94,30.16 arc90 14.29,28.51 14.29,24.45 arc90 14.66,24.08 U2.1
GPIO32
  Top 0.152: S2.2 S2.1 11.97,44.28 10.44,42.75 10.44,34.57 arc-90 9.84,33.97 3.17,33.97 arc90 2.82,33.62 2.82,20.04 arc90 3.81,19.05 16.19,19.05 16.61,18.63 J4.7
GPIO33
  Top 0.152: S1.1 S1.2 10.16,43.92 10.16,34.67 arc-90 9.7,34.21 3.08,34.21 arc90 2.58,33.72 2.58,19.94 arc90 3.71,18.81 14.85,18.81 15.24,18.41 15.24,16.51 15.53,16.22 18.76,16.22 19.15,16.61 J4.8
N$1
  Top 0.152: FB2.1 8.57,24.13 arc90 8.74,24.3 8.74,25.57 arc-90 9.21,26.04 | 9.21,26.04 U2.13 arc-90 U2.13 | 9.21,26.04 8.18,26.04 arc90 C5.1 7.9,25.76 C6.1
N$2
  Top 0.254: U1.P$3 24.21,26.75 arc-90 24.45,26.99 25.4,26.99 arc90 25.72,27.3 C3.1
N$3
  Top 0.152: U2.7 18.51,27.98 arc-90 R2.2
N$4
  Top 0.254: U1.P$7 22.61,26.92 arc90 22.54,26.99 22.23,26.99 arc-90 21.91,27.3 C4.1
N$5
  Top 0.152: U2.11 9.82,27.33 arc-90 9.53,27.62 9.53,28.26 arc90 9.21,28.57 arc-90 8.89,28.89 8.89,31.11 arc90 8.38,31.62 5.59,31.62 arc90 5.08,31.11 5.08,30.61 arc-90 R3.2
N$6
  Top 0.152: U2.8 17.52,28.63 arc90 17.78,28.89 arc-90 18.1,29.21 R4.2
N$8
  Top 0.152: R20.2 28.07,21.15 PWR.C
N$10
  Top 0.152: R6.2 13.15,28.39 arc-90 12.7,27.94 10.77,27.94 U2.10
N$11
  Top 0.152: U2.6 17.76,27.33 arc-90 18.1,26.99 arc90 18.41,26.67 18.73,26.67 arc-90 18.87,26.54 R7.2
N$14
  Top 0.152: U2.12 9.2,26.68 arc-90 8.89,26.99 8.89,27.62 arc90 8.57,27.94 8.26,27.94 arc-90 7.94,28.26 7.94,28.86 arc90 C10.1 arc90 7.94,28.93 7.94,30.4 arc90 C12.1
N$15
  Top 0.254: U2.14 12.72,25.38 arc-90 13.02,25.08 13.02,24.13 arc-90 12.7,23.81 12.06,23.81 arc90 11.84,23.58 C8.1
N$16
  Top 0.254: R9.2 6.35,22.23 arc-90 6.67,21.91 6.67,21.36 arc90 C9.2
N$17  (via drill 0.35)
  Top 0.254: U1.P$9 23.01,20.47 arc-90 22.23,19.68 21.27,19.68 arc90 20.32,18.73 v20.32,16.83
  Bottom 0.254: v20.32,16.83 20.32,14.61 arc-90 19.8,14.08 4.45,14.08 arc90 J1.2
N$18  (via drill 0.35)
  Top 0.254: U1.P$14 arc90 25.44,22.86 26.32,22.86 arc90 26.64,23.19 26.64,29.87 arc90 v26.35,30.16
  Bottom 0.254: v26.35,30.16 20.95,30.16 arc-90 20.32,30.8 arc90 20,31.11 18.73,31.11 arc-90 17.78,32.07 17.78,33.34 arc90 17.14,33.97 4.13,33.97 arc-90 2.22,35.88 2.22,38.85 arc-90 J2.2
N$19
  Top 0.152: 15.02,21.45 arc90 C8.2
  Top 0.254: C8.2 arc-90 15.02,21.45 R8.2
N$20  (via drill 0.2)
  Top 0.152: v15.24,39.05 15.24,39.37 15.56,39.69 R11.2
  Bottom 0.152: IC1.2 15.24,38.77 v15.24,39.05
N$21
  Top 0.152: 9.53,21.5 arc90 C9.1
  Top 0.254: U2.16 9.79,24.08 arc90 9.53,23.81 9.53,21.5
N$22  (via drill 0.2)
  Top 0.152: v13.97,38.1 13.65,38.42 R13.2
  Bottom 0.152: IC1.6 14.47,37.47 13.97,37.97 v13.97,38.1
N$24
  Top 0.152: JP1.1 14.07,5.08 14.42,5.43 R19.1
N$25
  Top 0.152: R18.2 10.39,7.26 10.39,4.36 9.84,3.81 JP1.5
N$26  (via drill 0.35)
  Top 0.254: U1.P$13 24.61,23.01 arc90 25.18,22.44 26.38,22.44 arc90 27.09,23.15 27.09,30.38 arc90 v26.67,30.8
  Bottom 0.254: v26.67,30.8 26.66,30.78 22.54,30.78 arc-90 20.32,33.01 20.32,33.38 arc90 19.09,34.61 5.08,34.61 arc-90 3.81,35.88 J2.1
N$27
  Top 0.152: R17.2 28.07,18.91 SDCRD.C
N$28  (via drill 0.35)
  Top 0.254: U1.P$10 23.41,19.04 arc-90 23.16,18.8 arc90 22.87,18.5 v22.87,16.82
  Bottom 0.254: v22.87,16.82 22.87,14.28 arc-90 22.19,13.59 7.14,13.59 arc90 6.35,12.8 6.35,10.79 arc-90 5.5,9.95 J1.1
RESET
  Top 0.152: S3.1 S3.2 27.8,28.75 27.38,28.33 27.38,26.35 27.38,16.9 26.67,16.19 22.23,16.19 21.69,16.73 J4.9
SHUTDOWN
  Top 0.152: U1.P$2 24.61,25.87 arc90 24.82,25.67 25.13,25.67 arc-90 25.4,25.4 25.4,24.13 arc-90 25.13,23.86 22.28,23.86 arc90 21.91,23.5 R1.2
VINL
  Top 0.254: X1.4 26.35,40.53 26.35,31.75 25.72,31.11 C3.2 24.62,29.25 R10.2
VINR
  Top 0.254: X1.3 25.79,36.29 25.79,31.75 24.84,30.8 23.5,30.8 23.18,30.48 R12.2 23,29.25 C4.2
VOUTL
  Top 0.254: X1.5 22.91,45.73 22.23,45.04 22.23,33.97 22.86,33.34 22.86,32.12 20.7,29.96 20.7,22.41 18.64,20.36 C13.1 16.61,20.36 R8.1
VOUTR
  Top 0.254: R9.1 3.85,22.01 C14.1 3.85,19.65 arc90 4.13,19.37 18.13,19.37 21.07,22.3 21.07,29.84 22.65,31.43 24.77,31.43 25.4,32.07 25.4,33.35 23.86,34.89 X1.2

### Text on the board
bPlace: http:/www.aksevenfour.com
tNames: + | - | RESET
bNames: TinyPICO Audio Board | - | LEFT | + | BAT | GND | 5V | 3V3 | 4 | 14 | 15 | 27 | 26 | 25 | 5V | MIC | SDCARD | DAC | 3V | 4 / 14 / 15 | 19 / 23 / 18 / 5 | 26 / 27 / 22 | WS: / BCK: / DI: | MISO: / MOSI: / SCK: / CS: | WS: / BCK: / DO: | DEEM | GND | 23 | 19 | 18 | 5 | 22 | 21 | 32 | 33 | RST | GND | SPARE | INFO | - | SPH0645LM4H / UDA1334A / MAX98306 / v0.10 / AKSevenFour / 06/09 | RIGHT | 21 / 25 | #1: / #2: | + | 21 | MO | MI | SCK | 25 | GAIN | 15dB | 12dB | 9dB | 18dB | MIC: / DAC: / AMP: / VER: / MAN: